# Altium schematic sheet Chanal.SchDoc
size A4; Organization: Altium Limited; Address1: L3, 12a Rodborough Rd; Address2: Frenchs Forest; Address3: NSW; Address4: Australia 2086
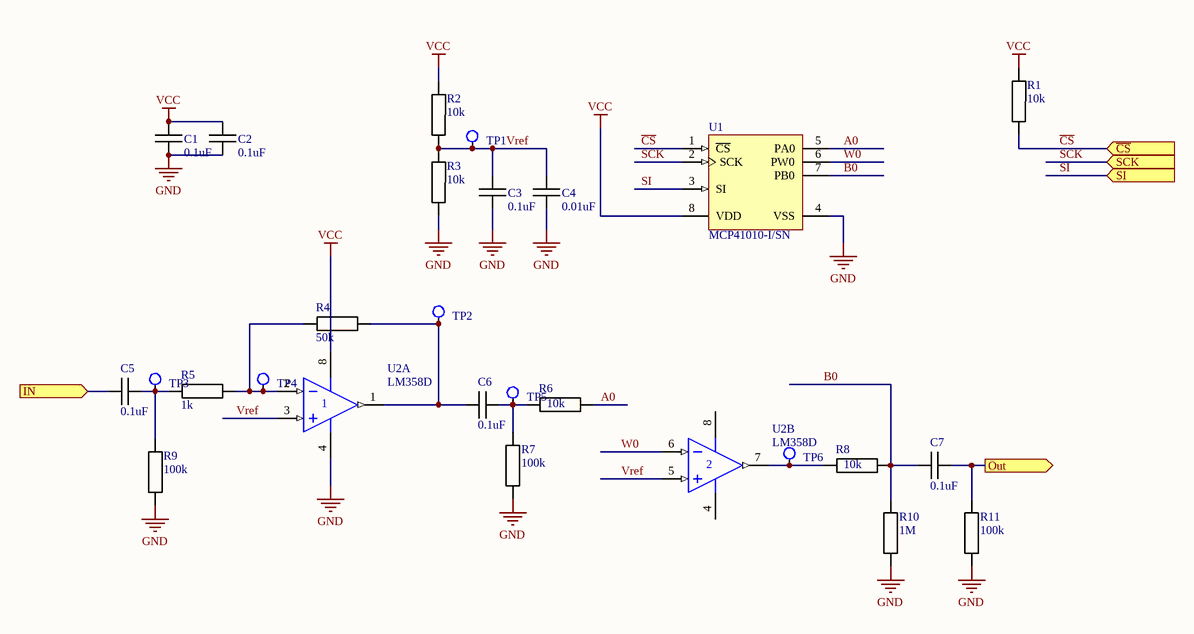
[diagram p0: Chanal.SchDoc]

## Parts
C1  0.1uF  [SMD 0603]
C2  0.1uF  [SMD 0603]
C3  0.1uF  [SMD 0603]
C4  0.01uF  [SMD 0603]
C5  0.1uF  [SMD 0603]
C6  0.1uF  [SMD 0603]
C7  0.1uF  [SMD 0603]
R1  10k  [SMD 0603]
R2  10k  [SMD 0603]
R3  10k  [SMD 0603]
R4  50k  [SMD 0603]
R5  1k  [SMD 0603]
R6  10k  [SMD 0603]
R7  100k  [SMD 0603]
R8  10k  [SMD 0603]
R9  100k  [SMD 0603]
R10  1M  [SMD 0603]
R11  100k  [SMD 0603]
TP1  testPoint  [TESTPOINT]  (value not drawn)
TP2  testPoint  [TESTPOINT]  (value not drawn)
TP3  testPoint  [TESTPOINT]  (value not drawn)
TP4  testPoint  [TESTPOINT]  (value not drawn)
TP5  testPoint  [TESTPOINT]  (value not drawn)
TP6  testPoint  [TESTPOINT]  (value not drawn)
U1  MCP41010-I/SN  [SOIC-SN8_N]
U2  LM358D  [751-02_N]  (parts A,B of 2)

## Ports
IN (in), Out (out), SCK (in), SI (in), ~{CS} (in)

## Nets
GND: C1.2 C2.2 C3.2 C4.2 R3.1 R7.2 R9.2 R10.2 R11.2 U1.4(VSS) U2.4(V-)
VCC: C1.1 C2.1 R1.2 R2.2 U1.8(VDD) U2.8(V+)
~{CS}: R1.1 U1.1(~{CS}) ; port ~{CS}
A0: R6.1 U1.5(PA0)
B0: C7.1 R8.1 R10.1 U1.7(PB0)
IN: C5.1 ; port IN
Out: C7.2 R11.1 ; port Out
SCK: U1.2(SCK) ; port SCK
SI: U1.3(SI) ; port SI
Vref: C3.1 C4.1 R2.1 R3.2 TP1.0 U2.3(IN+) U2.5(IN+)
W0: U1.6(PW0) U2.6(IN-)
NetC5_2: C5.2 R5.2 R9.1 TP3.0
NetC6_1: C6.1 R4.1 TP2.0 U2.1(OUT)
NetC6_2: C6.2 R6.2 R7.1 TP5.0
NetR4_2: R4.2 R5.1 TP4.0 U2.2(IN-)
NetR8_2: R8.2 TP6.0 U2.7(OUT)

## Notes on the sheet
- Title
- Size:
- Date:
- A4
- Number:
- Time:
- Revision:
- Sheet
- of
- File:

## Library data of the parts
C1-C7 = Capasitor
  C1-C3 C5-C7: Value: 0.1uF
  C4: Value: 0.01uF
R1-R11 = Resistor
  R1-R3 R6 R8: Value: 10k
  R4: Value: 50k
  R5: Value: 1k
  R7 R9 R11: Value: 100k
  R10: Value: 1M
U1 = MCP41010-I/SN: Single/Dual Digital Potentiometer with SPI Interface, 8-Pin SOIC 150mil, Industrial Temperature; Manufacturer: Microchip; DatasheetVersion: Jul-2003; PackageVersion: revBB, Aug-2009; PackageReference: SOIC-SN8; PackageDescription: 8-Lead Plastic Small Outline (SN) - Narrow, 3.90mm Body [SOIC]; Supplier 1: Digi-Key; Supplier Part Number 1: MCP41010-I/SN-ND; Supplier 2: Farnell; Supplier Part Number 2: 9758607; Supplier 3: Newark; Supplier Part Number 3: 61K2949; Supplier 4: Mouser; Supplier Part Number 4: 579-MCP41010-I/SN; Mounting Technology: Surface Mount; Code_JEDEC: MS-012; Code_IPC: SOIC127P600-8; PartNumber: MCP41010-I/SN; ComponentLink1Description: Manufacturer URL; ComponentLink1URL: http://www.microchip.com/; ComponentLink2Description: Datasheet; ComponentLink2URL: http://ww1.microchip.com/downloads/en/DeviceDoc/11195c.pdf; ComponentLink3Description: Package Specification; ComponentLink3URL: http://www.microchip.com/stellent/groups/techpub_sg/documents/packagingspec/en012702.pdf
U2 = LM358D: Dual Low-Power Operational Amplifier; Published: 17-Jul-2002; LatestRevisionDate: 13-Apr-2006; LatestRevisionNote: IPC-7351 Footprint Added.; DatasheetVersion: 1988; PackageReference: 751-02; Publisher: Altium Limited; PackageDescription: 8-Pin Small Outline Integrated Circuit 1.27 mm Pitch; Code_JEDEC: MS-012-AA; Code_IPC: SOIC127P600-8; ComponentLink1Description: Manufacturer Link; ComponentLink1URL: http://www.onsemi.com/site/products/parametrics/0,4446,251,00.html; ComponentLink2Description: Datasheet; ComponentLink2URL: http://www.onsemi.com/pub/Collateral/LM358-D.PDF